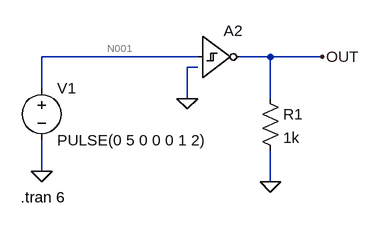
[diagram p0: schematic Draft4.asc]
Draft4.asc, the LTspice schematic file:
Version 4.1
SHEET 1 880 680
WIRE 176 240 -64 240
WIRE 288 240 240 240
WIRE 368 240 288 240
WIRE 176 256 160 256
WIRE -64 288 -64 240
WIRE 160 304 160 256
WIRE 288 304 288 240
WIRE -64 416 -64 368
WIRE 288 432 288 384
FLAG -64 416 0
FLAG 288 432 0
FLAG 368 240 OUT
FLAG 160 304 0
SYMBOL Digital\\schmtinv 176 176 R0
SYMATTR InstName A2
SYMBOL voltage -64 272 R0
WINDOW 123 0 0 Left 0
WINDOW 39 0 0 Left 0
SYMATTR InstName V1
SYMATTR Value PULSE(0 5 0 0 0 1 2)
SYMBOL res 272 288 R0
SYMATTR InstName R1
SYMATTR Value 1k
TEXT -96 456 Left 2 !.tran 6

The netlist it stands for:
* Draft4.asc
A2 N001 0 0 0 0 OUT 0 0 SCHMITT
V1 N001 0 PULSE(0 5 0 0 0 1 2)
R1 OUT 0 1k
.tran 6
.backanno
.end

* Results of the author's LTspice run, read from the files saved beside the schematic
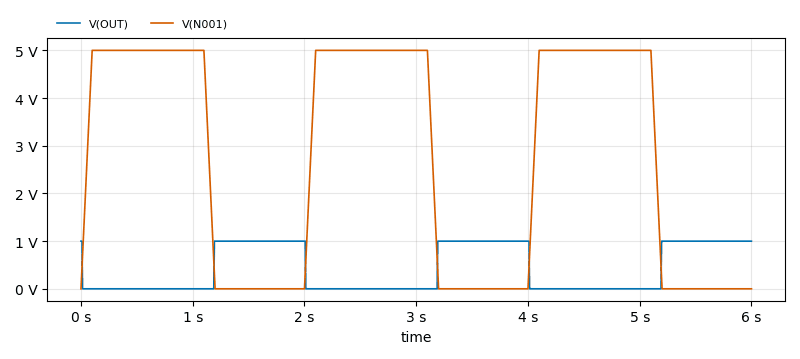
[diagram p1: Transient Analysis of Draft4.asc, plotted from the saved traces]
* Transient Analysis, 1 run:
*   V(OUT): min 0 V, max 999 mV, average 409.3 mV, rms 639.4 mV, last 999 mV
*   V(N001): min 0 V, max 5 V, average 2.75 V, rms 3.689 V, last 0 V